# EAGLE design zynthia (EAGLE 6.5.0)
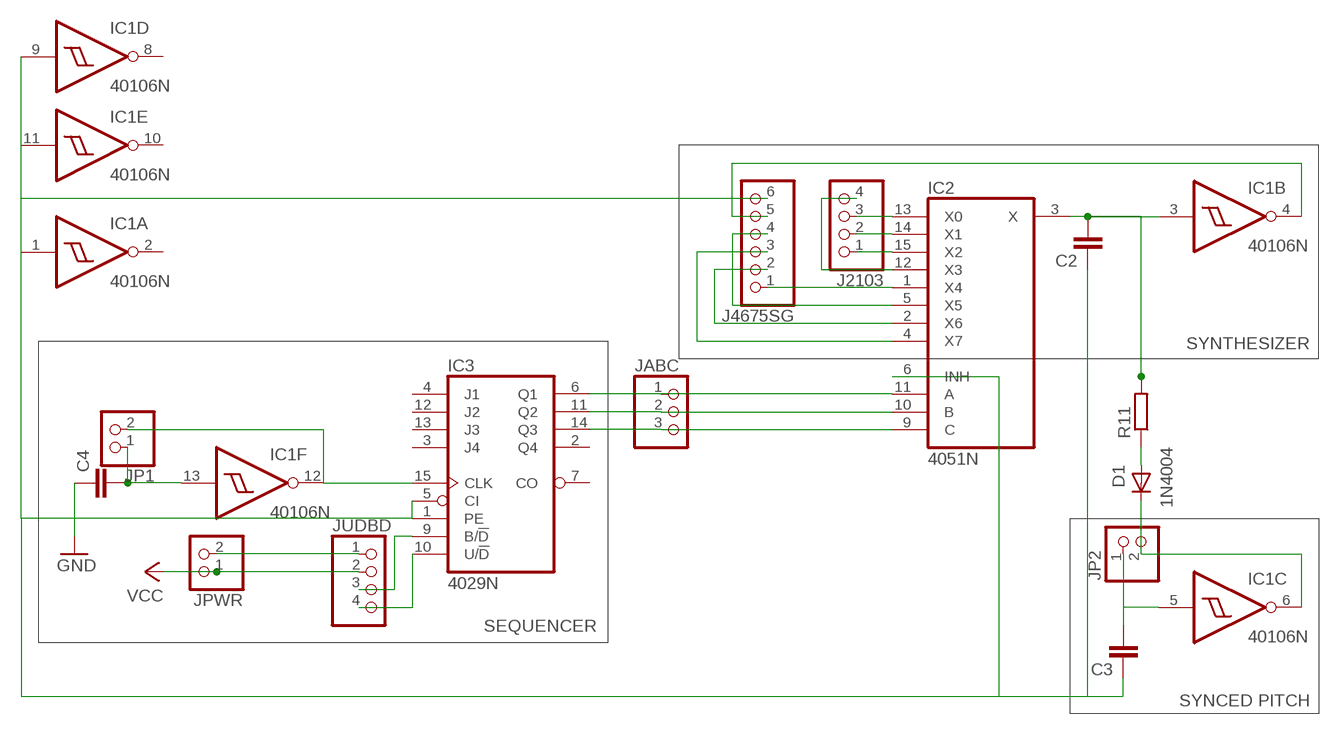
[diagram p0: schematic, sheet 1]

## Parts
C2  C-EU025-024X044  [C025-024X044]
C3  C-EU025-024X044  [C025-024X044]
C4  C-EU025-024X044  [C025-024X044]
D1  1N4004  [DO41-10]
IC1  40106N  [DIL14]
IC2  4051N  [DIL16]
IC3  4029N  [DIL16]
J2103  PINHD-1X4  [1X04]
J4675SG  PINHD-1X6  [1X06]
JABC  PINHD-1X3  [1X03]
JP1  PINHD-1X2  [1X02]
JP2  PINHD-1X2  [1X02]
JPWR  PINHD-1X2  [1X02]
JUDBD  PINHD-1X4  [1X04]
R11  R-EU_0204/2V  [0204V]

## Nets
GND: C4.1
N$1: IC1.12(F:O) IC3.15(CLK) JP1.2
N$2: C4.2 IC1.13(F:I) JP1.1
N$3: C2.2 IC1.3(B:I) IC2.3(X) R11.2
N$4: C3.2 IC1.5(C:I) JP2.1
N$5: IC2.13(X0) J2103.3
N$6: IC3.10(U/!D) JUDBD.4
N$7: IC3.9(B/!D) JUDBD.3
N$8: IC2.9(C) IC3.14(Q3) JABC.3
N$9: IC2.10(B) IC3.11(Q2) JABC.2
N$10: IC2.11(A) IC3.6(Q1) JABC.1
N$11: JPWR.2 JUDBD.1
N$12: IC2.5(X5) J4675SG.4
N$13: IC2.1(X4) J4675SG.1
N$14: IC2.4(X7) J4675SG.3
N$15: IC1.4(B:O) J4675SG.5
N$17: IC2.15(X2) J2103.1
N$18: IC2.12(X3) J2103.4
N$23: D1.C IC1.6(C:O) JP2.2
N$24: D1.A R11.1
N$26: IC2.2(X6) J4675SG.2
N$28: IC2.14(X1) J2103.2
VCC: JPWR.1 JUDBD.2
VEE: C2.1 C3.1 IC1.1(A:I) IC1.9(D:I) IC1.11(E:I) IC2.6(INH) IC3.1(PE) IC3.5(CI) J4675SG.6
Unconnected: IC1.2(A:O) IC1.8(D:O) IC1.10(E:O) IC3.2(Q4) IC3.3(J4) IC3.4(J1) IC3.7(CO) IC3.12(J2) IC3.13(J3)

## Notes on the sheet
- SYNTHESIZER
- SEQUENCER
- SYNCED PITCH

## Power pins joined to a net without a drawn wire
VCC: IC1.14(P:VDD) IC2.16(VCC) IC3.16(VDD)
VEE: IC1.7(P:VSS) IC2.7(VEE) IC2.8(GND) IC3.8(VSS)

## Library data of the parts
C2-C4 = rcl:C-EU: CAPACITOR, European symbol
D1 = diode:1N4004: DIODE general purpose rectifier, 1 A
IC1 = 40xx:40106: Hex SCHMITT TRIGGER
IC2 = 40xx:4051: 8-channel ANALOG MULTIPLEXER
IC3 = 40xx:4029: Binary/decimal up/down COUNTER
J2103 JUDBD = pinhead:PINHD-1X4: PIN HEADER
J4675SG = pinhead:PINHD-1X6: PIN HEADER
JABC = pinhead:PINHD-1X3: PIN HEADER
JP1 JP2 JPWR = pinhead:PINHD-1X2: PIN HEADER
R11 = resistor:R-EU_: RESISTOR, European symbol

## Board
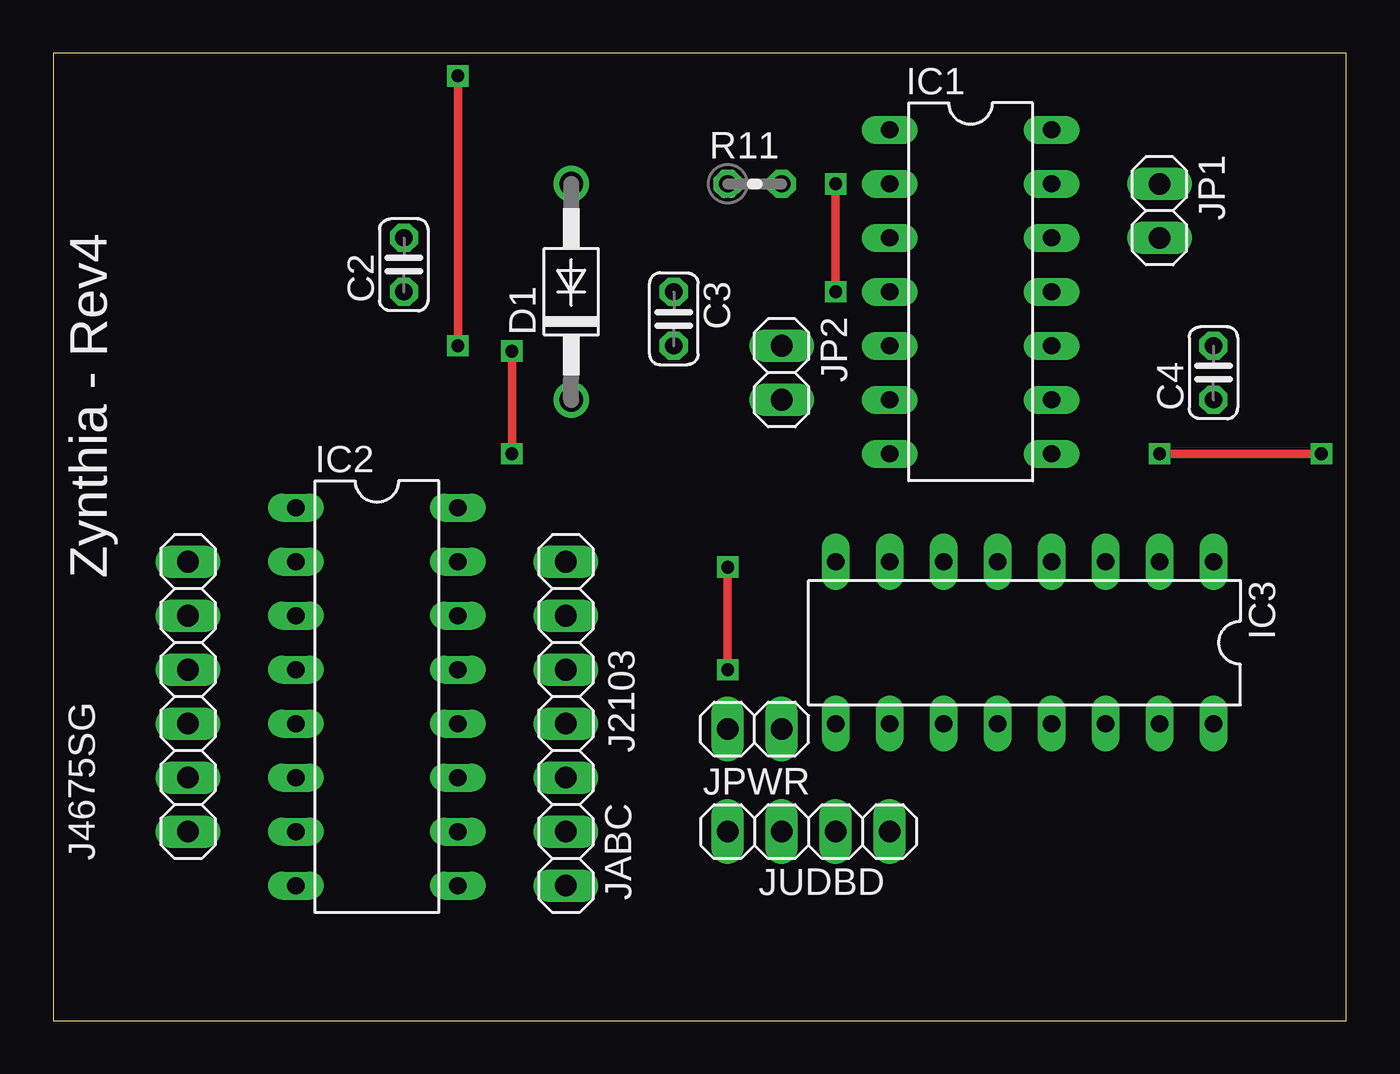
[diagram p1: board, top side]
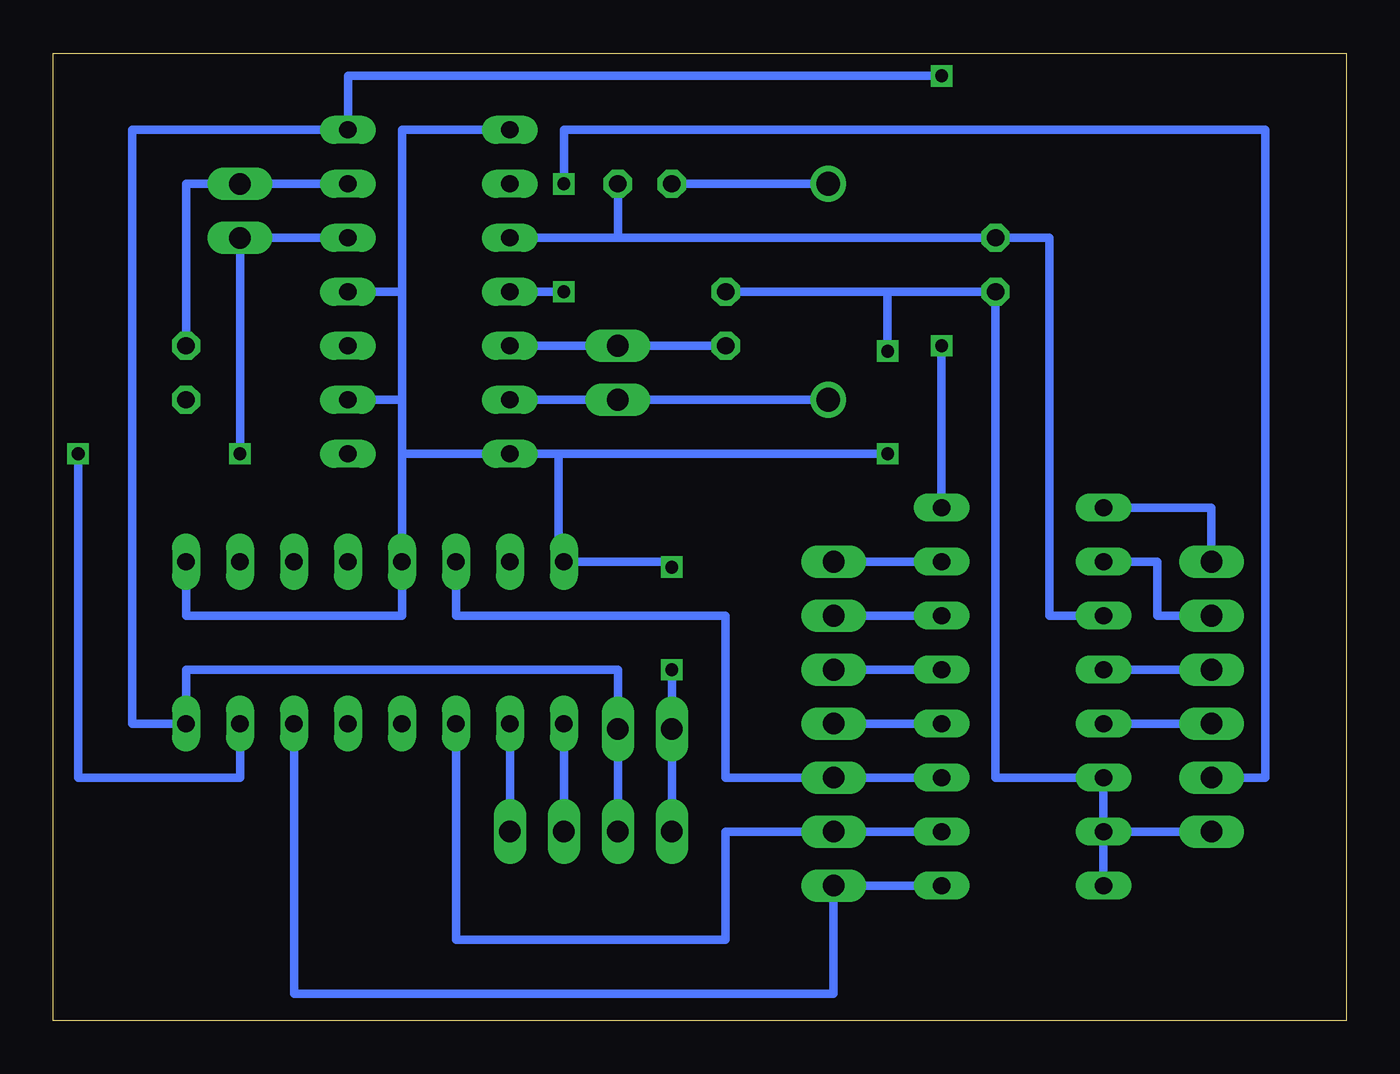
[diagram p2: board, bottom side, seen from below]

Size 60.87 x 45.52 mm. Coordinates in mm from the lower left corner, seen from the top.
Outline: 0,0 60.87,0 60.87,45.52 0,45.52 0,0
Copper layers (1*16): Top 0.035mm / dielectric 1.5mm / Bottom 0.035mm
Design rules "default": minimum track width 10mil, minimum drill 24mil, track to track 8mil, track to pad 8mil, pad to pad 8mil, via to via 8mil, smd to smd 8mil, copper to edge 40mil, drill to drill 8mil, minimum pad ring 10mil, minimum via ring 8mil, stop-mask expansion 4mil, vias tented up to drill 0mil, thermal gap 10mil

### Footprints (pad centres in the part's own frame; a part is rotated, then mirrored left to right if it is on the bottom)
C025-024X044 = drill 0.813 octagon: 1 -1.27,0; 2 1.27,0
DO41-10 = drill 1.118: A 5.08,0; C -5.08,0
DIL14 = drill 0.813 long: 1 -7.62,-3.81; 2 -5.08,-3.81; 3 -2.54,-3.81; 4 0,-3.81; 5 2.54,-3.81; 6 5.08,-3.81; 7 7.62,-3.81; 8 7.62,3.81; 9 5.08,3.81; 10 2.54,3.81; 11 0,3.81; 12 -2.54,3.81; 13 -5.08,3.81; 14 -7.62,3.81
DIL16 = drill 0.813 long: 1 -8.89,-3.81; 2 -6.35,-3.81; 3 -3.81,-3.81; 4 -1.27,-3.81; 5 1.27,-3.81; 6 3.81,-3.81; 7 6.35,-3.81; 8 8.89,-3.81; 9 8.89,3.81; 10 6.35,3.81; 11 3.81,3.81; 12 1.27,3.81; 13 -1.27,3.81; 14 -3.81,3.81; 15 -6.35,3.81; 16 -8.89,3.81
1X04 = drill 1.016 long: 1 -3.81,0; 2 -1.27,0; 3 1.27,0; 4 3.81,0
1X06 = drill 1.016 long: 1 -6.35,0; 2 -3.81,0; 3 -1.27,0; 4 1.27,0; 5 3.81,0; 6 6.35,0
1X03 = drill 1.016 long: 1 -2.54,0; 2 0,0; 3 2.54,0
1X02 = drill 1.016 long: 1 -1.27,0; 2 1.27,0
0204V = drill 0.813 octagon: 1 -1.27,0; 2 1.27,0

### Placement (x,y rotation side)
C2  16.51,35.56 90 top
C3  29.21,33.02 270 top
C4  54.61,30.48 90 top
D1  24.38,34.29 90 top
IC1  43.18,34.29 270 top
IC2  15.24,15.24 270 top
IC3  45.72,17.78 180 top
J2103  24.13,17.78 270 top
J4675SG  6.35,15.24 270 top
JABC  24.13,8.89 270 top
JP1  52.07,38.1 270 top
JP2  34.29,30.48 270 top
JPWR  33.02,13.72 180 top
JUDBD  35.56,8.89 0 top
R11  33.02,39.37 0 top

### Tracks (layer width: path | path; a pad name or v marks a point on that pad's centre or on a via)
N$1  (via drill 0.6)
  Top 0.406: v59.69,26.67 v52.07,26.67
  Bottom 0.406: IC1.12 JP1.2 v52.07,26.67 | IC3.15 52.07,11.43 59.69,11.43 v59.69,26.67
N$2
  Bottom 0.406: IC1.13 JP1.1 54.61,39.37 C4.2
N$3
  Bottom 0.406: 34.29,36.83 IC1.3 | 34.29,36.83 C2.2 13.97,36.83 13.97,19.05 IC2.3 | 34.29,36.83 R11.2
N$4
  Bottom 0.406: IC1.5 JP2.1 C3.2
N$5
  Bottom 0.406: IC2.13 J2103.3
N$6
  Bottom 0.406: JUDBD.4 IC3.10
N$7
  Bottom 0.406: JUDBD.3 IC3.9
N$8
  Bottom 0.406: IC3.14 49.53,1.27 24.13,1.27 JABC.3 IC2.9
N$9
  Bottom 0.406: IC2.10 JABC.2 29.21,8.89 29.21,3.81 41.91,3.81 IC3.11
N$10
  Bottom 0.406: IC2.11 JABC.1 29.21,11.43 29.21,19.05 41.91,19.05 IC3.6
N$11
  Bottom 0.406: JPWR.2 JUDBD.1
N$12
  Bottom 0.406: J4675SG.4 IC2.5
N$13
  Bottom 0.406: IC2.1 6.35,24.13 J4675SG.1
N$14
  Bottom 0.406: J4675SG.3 IC2.4
N$15  (via drill 0.6)
  Top 0.406: v36.83,34.29 v36.83,39.37
  Bottom 0.406: IC1.4 v36.83,34.29 | v36.83,39.37 36.83,41.91 3.81,41.91 3.81,11.43 J4675SG.5
N$17
  Bottom 0.406: IC2.15 J2103.1
N$18
  Bottom 0.406: IC2.12 J2103.4
N$23
  Bottom 0.406: D1.C JP2.2 IC1.6
N$24
  Bottom 0.406: D1.A R11.1
N$26
  Bottom 0.406: IC2.2 8.89,21.59 8.89,19.05 J4675SG.2
N$28
  Bottom 0.406: IC2.14 J2103.2
VCC  (via drill 0.6)
  Top 0.406: v19.05,44.45 v19.05,31.75
  Bottom 0.406: v19.05,44.45 46.99,44.45 IC1.14 57.15,41.91 57.15,13.97 IC3.16 54.61,16.51 34.29,16.51 34.29,15.24 JPWR.1 JUDBD.2 | v19.05,31.75 IC2.16
VEE  (via drill 0.6)
  Top 0.406: v21.59,31.5 v21.59,26.67 | v31.75,21.34 v31.75,16.51
  Bottom 0.406: 21.59,34.29 v21.59,31.5 | v21.59,26.67 37.08,26.67 | 37.08,26.67 IC1.7 44.45,26.67 | 37.08,26.67 37.08,21.59 IC3.8 31.75,21.59 v31.75,21.34 | IC2.7 IC2.8 | IC3.1 54.61,19.05 44.45,19.05 IC3.5 44.45,26.67 | C3.1 21.59,34.29 | IC1.1 44.45,41.91 44.45,34.29 | 44.45,34.29 44.45,29.21 | IC1.11 44.45,34.29 | IC1.9 44.45,29.21 | 21.59,34.29 C2.1 16.51,11.43 IC2.6 IC2.7 | 44.45,29.21 44.45,26.67 | J4675SG.6 IC2.7 | v31.75,16.51 31.75,8.89

### Text on the board
tNames: Zynthia - Rev4